# EAGLE design OMSI_TABLE_R12_v4 (EAGLE 9.6.1)
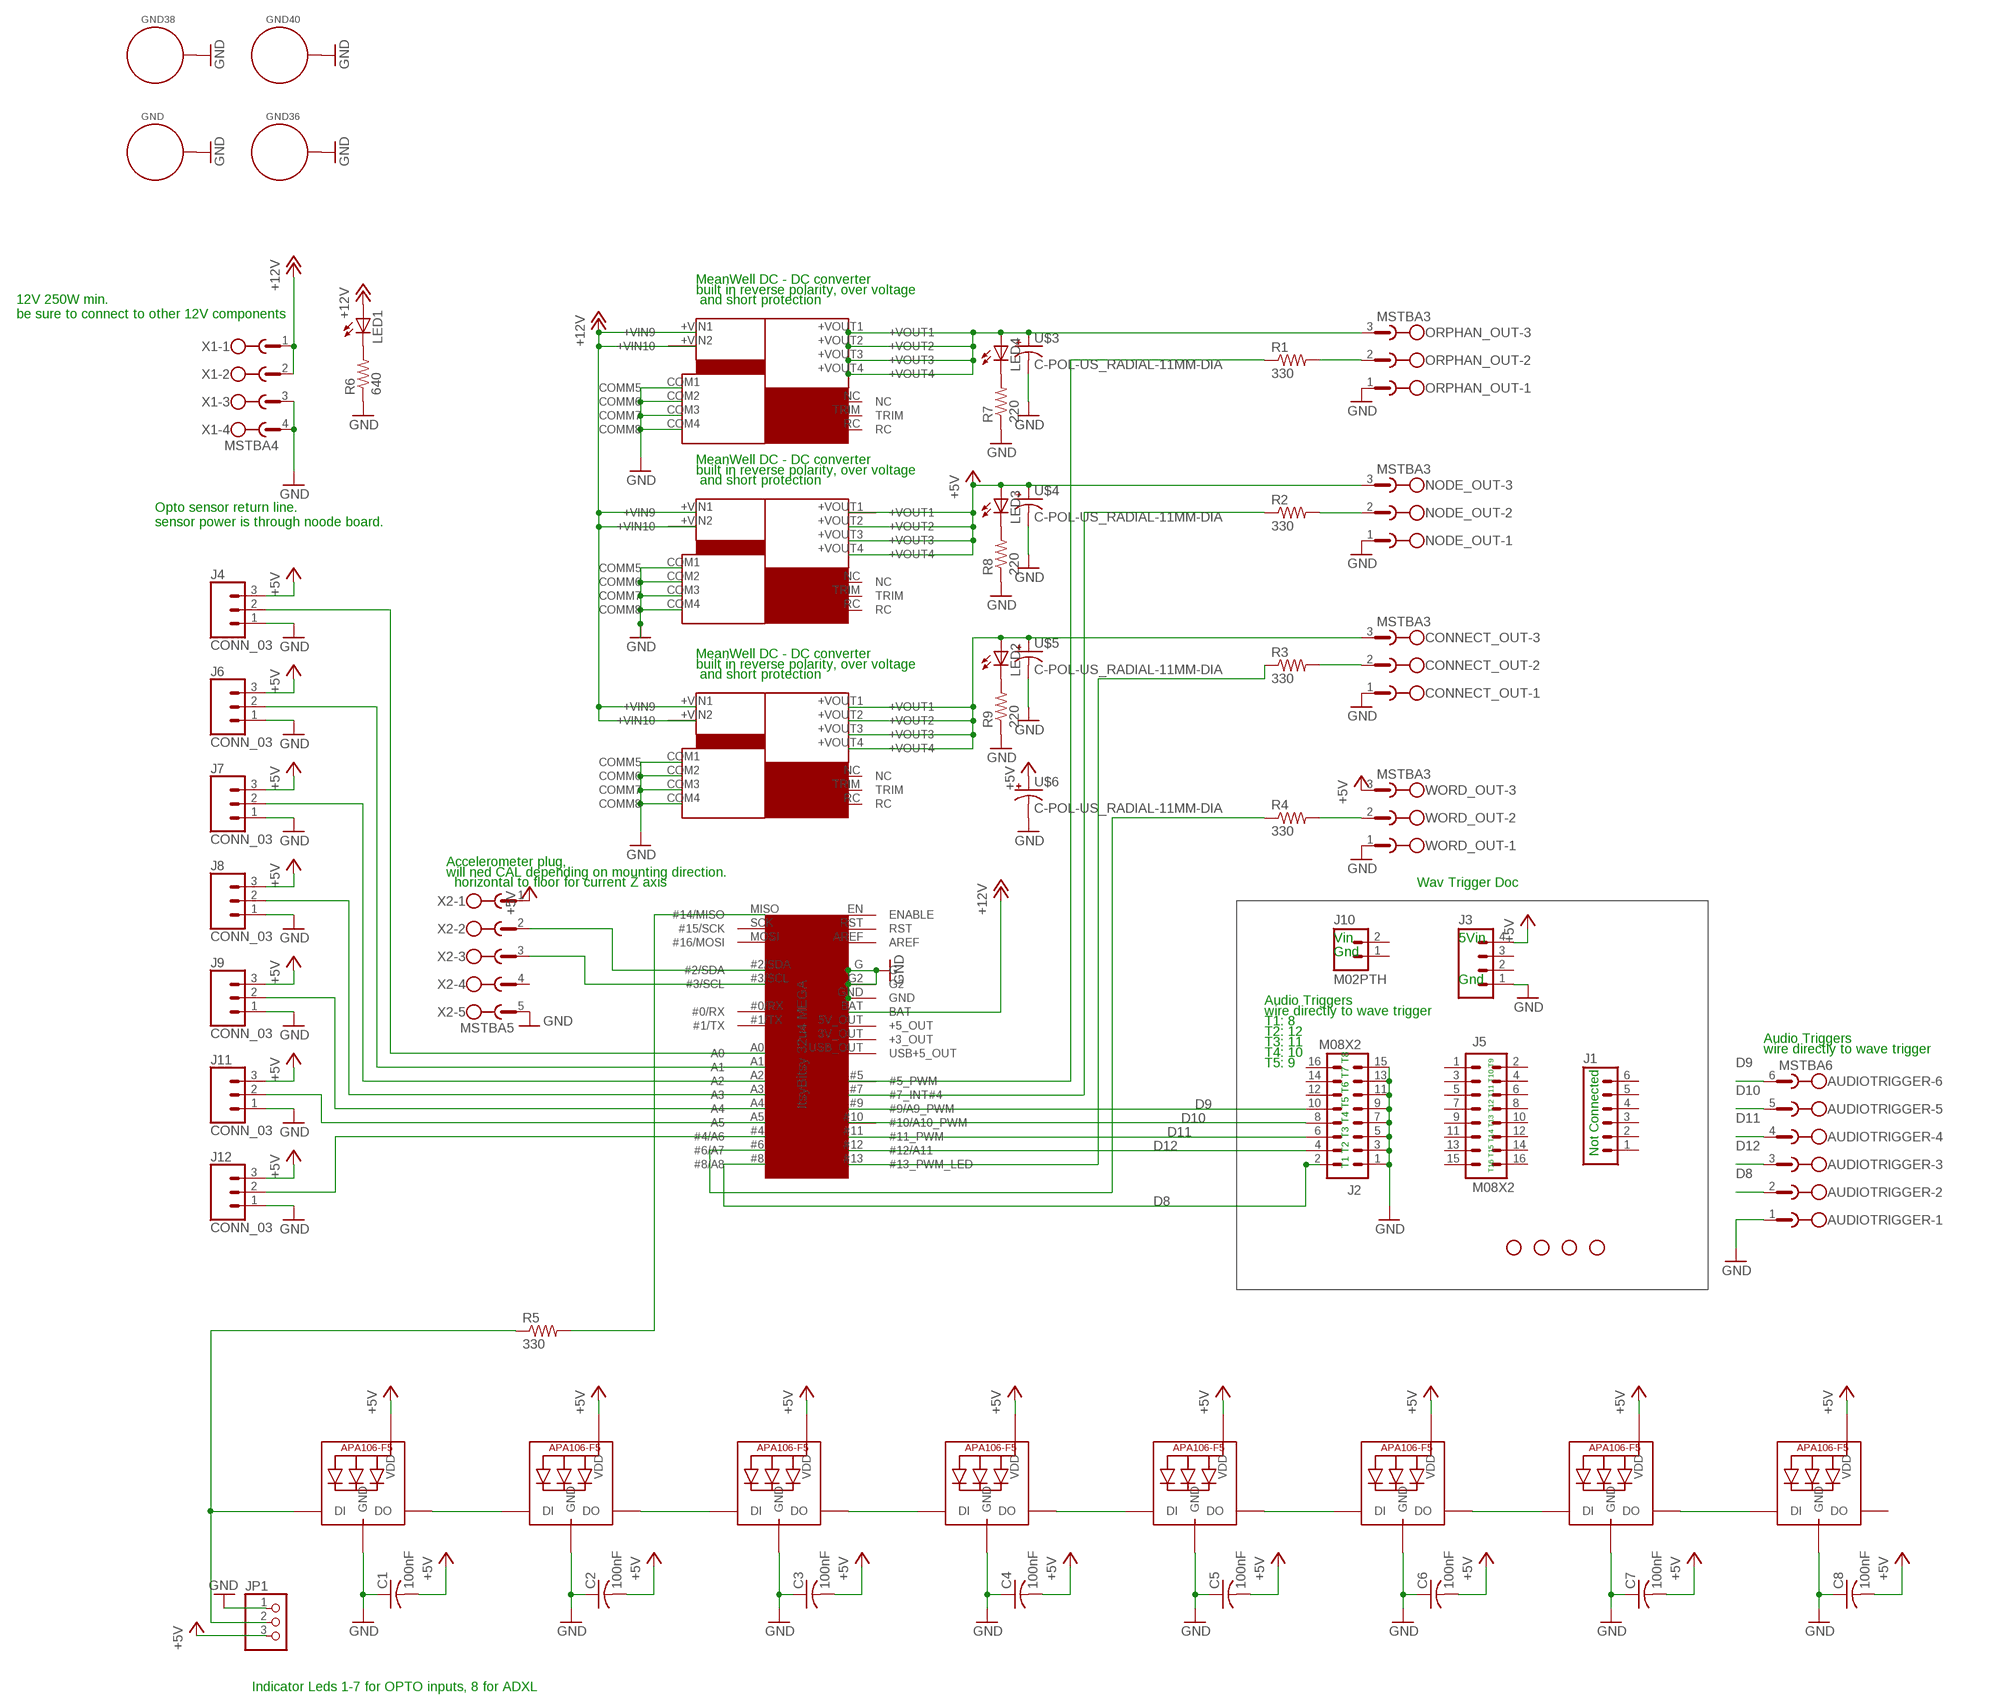
[diagram p0: schematic, sheet 1]

## Parts
AUDIOTRIGGER  MSTBA6  [MSTBA6]
C1  100nF  C-USC0805  [C0805]
C2  100nF  C-USC0805  [C0805]
C3  100nF  C-USC0805  [C0805]
C4  100nF  C-USC0805  [C0805]
C5  100nF  C-USC0805  [C0805]
C6  100nF  C-USC0805  [C0805]
C7  100nF  C-USC0805  [C0805]
C8  100nF  C-USC0805  [C0805]
CONNECT_OUT  MSTBA3  [MSTBA3]
GND  STANDOFF_ELECTRICAL5-32  [STANDOFF_ELECTRICAL_5_32]
GND36  STANDOFF_ELECTRICAL5-32  [STANDOFF_ELECTRICAL_5_32]
GND38  STANDOFF_ELECTRICAL5-32  [STANDOFF_ELECTRICAL_5_32]
GND40  STANDOFF_ELECTRICAL5-32  [STANDOFF_ELECTRICAL_5_32]
J1  M06SIP  [1X06]
J2  M08X2  [2X8]
J3  M04PTH  [1X04]
J4  CONN_03  [1X03_3.5MM_RA]
J5  M08X2  [2X8]
J6  CONN_03  [1X03_3.5MM_RA]
J7  CONN_03  [1X03_3.5MM_RA]
J8  CONN_03  [1X03_3.5MM_RA]
J9  CONN_03  [1X03_3.5MM_RA]
J10  M02PTH  [1X02]
J11  CONN_03  [1X03_3.5MM_RA]
J12  CONN_03  [1X03_3.5MM_RA]
JP1  PINHD-1X3  [1X03]
LED1  LEDCHIPLED_1206  [CHIPLED_1206]
LED2  LEDCHIPLED_1206  [CHIPLED_1206]
LED3  LEDCHIPLED_1206  [CHIPLED_1206]
LED4  LEDCHIPLED_1206  [CHIPLED_1206]
LED5  APA106-F5  [APA106-F5]
LED6  APA106-F5  [APA106-F5]
LED7  APA106-F5  [APA106-F5]
LED8  APA106-F5  [APA106-F5]
LED9  APA106-F5  [APA106-F5]
LED10  APA106-F5  [APA106-F5]
LED11  APA106-F5  [APA106-F5]
LED12  APA106-F5  [APA106-F5]
MEANWELL_NID100_1  MEANWELL_NID100  [MEANWELL_NID100]
MEANWELL_NID100_2  MEANWELL_NID100  [MEANWELL_NID100]
MEANWELL_NID100_3  MEANWELL_NID100  [MEANWELL_NID100]
NODE_OUT  MSTBA3  [MSTBA3]
ORPHAN_OUT  MSTBA3  [MSTBA3]
R1  330  R-US_AXIAL-11.7MM-PITCH  [RESAD1176W63L850D250B]
R2  330  R-US_AXIAL-11.7MM-PITCH  [RESAD1176W63L850D250B]
R3  330  R-US_AXIAL-11.7MM-PITCH  [RESAD1176W63L850D250B]
R4  330  R-US_AXIAL-11.7MM-PITCH  [RESAD1176W63L850D250B]
R5  330  R-US_AXIAL-11.7MM-PITCH  [RESAD1176W63L850D250B]
R6  640  R-US_R0805  [R0805]
R7  220  R-US_R0805  [R0805]
R8  220  R-US_R0805  [R0805]
R9  220  R-US_R0805  [R0805]
STANDOFF5  STAND-OFF  [STAND-OFF]
STANDOFF6  STAND-OFF  [STAND-OFF]
STANDOFF7  STAND-OFF  [STAND-OFF]
STANDOFF8  STAND-OFF  [STAND-OFF]
U$1  ITSYBITSY_32U4  [ITSYBITSY_32U4]
U$3  C-POL-US_RADIAL-11MM-DIA  [CAPPRD508W65D1000H1100B]
U$4  C-POL-US_RADIAL-11MM-DIA  [CAPPRD508W65D1000H1100B]
U$5  C-POL-US_RADIAL-11MM-DIA  [CAPPRD508W65D1000H1100B]
U$6  C-POL-US_RADIAL-11MM-DIA  [CAPPRD508W65D1000H1100B]
WORD_OUT  MSTBA3  [MSTBA3]
X1  MSTBA4  [MSTBA4]
X2  MSTBA5  [MSTBA5]

## Nets
+5V: C1.2 C2.2 C3.2 C4.2 C5.2 C6.2 C7.2 C8.2 J3.4 J4.3 J6.3 J7.3 J8.3 J9.3 J11.3 J12.3 JP1.3 LED3.A LED5.P$3(VDD) LED6.P$3(VDD) LED7.P$3(VDD) LED8.P$3(VDD) LED9.P$3(VDD) LED10.P$3(VDD) LED11.P$3(VDD) LED12.P$3(VDD) MEANWELL_NID100_3.+VOUT1 MEANWELL_NID100_3.+VOUT2 MEANWELL_NID100_3.+VOUT3 MEANWELL_NID100_3.+VOUT4 NODE_OUT.3 U$4.1(+) U$6.1(+) WORD_OUT.3 X2.1
+12V: LED1.A MEANWELL_NID100_1.+VIN1(+VIN9) MEANWELL_NID100_1.+VIN2(+VIN10) MEANWELL_NID100_2.+VIN1(+VIN9) MEANWELL_NID100_2.+VIN2(+VIN10) MEANWELL_NID100_3.+VIN1(+VIN9) MEANWELL_NID100_3.+VIN2(+VIN10) U$1.BAT X1.1 X1.2
A0: J4.2 U$1.A0
A1: J6.2 U$1.A1
A2: J7.2 U$1.A2
A3: J8.2 U$1.A3
A4: J9.2 U$1.A4
A5: J11.2 U$1.A5
D4: J12.2 U$1.#4(#4/A6)
D6: R4.1 U$1.#6(#6/A7)
D8: AUDIOTRIGGER.2 J2.2 U$1.#8(#8/A8)
D9: AUDIOTRIGGER.6 J2.10 U$1.#9(#9/A9_PWM)
D10: AUDIOTRIGGER.5 J2.8 U$1.#10(#10/A10_PWM)
D11: AUDIOTRIGGER.4 J2.6 U$1.#11(#11_PWM)
D12: AUDIOTRIGGER.3 J2.4 U$1.#12(#12/A11)
D13: R3.1 U$1.#13(#13_PWM_LED)
GND: AUDIOTRIGGER.1 C1.1 C2.1 C3.1 C4.1 C5.1 C6.1 C7.1 C8.1 CONNECT_OUT.1 GND36.P1 GND38.P1 GND40.P1 GND.P1 J2.1 J2.3 J2.5 J2.7 J2.9 J2.11 J2.13 J2.15 J3.1 J4.1 J6.1 J7.1 J8.1 J9.1 J11.1 J12.1 JP1.1 LED5.P$2(GND) LED6.P$2(GND) LED7.P$2(GND) LED8.P$2(GND) LED9.P$2(GND) LED10.P$2(GND) LED11.P$2(GND) LED12.P$2(GND) MEANWELL_NID100_1.COM1(COMM5) MEANWELL_NID100_1.COM2(COMM6) MEANWELL_NID100_1.COM3(COMM7) MEANWELL_NID100_1.COM4(COMM8) MEANWELL_NID100_2.COM1(COMM5) MEANWELL_NID100_2.COM2(COMM6) MEANWELL_NID100_2.COM3(COMM7) MEANWELL_NID100_2.COM4(COMM8) MEANWELL_NID100_3.COM1(COMM5) MEANWELL_NID100_3.COM2(COMM6) MEANWELL_NID100_3.COM3(COMM7) MEANWELL_NID100_3.COM4(COMM8) NODE_OUT.1 ORPHAN_OUT.1 R6.1 R7.1 R8.1 R9.1 U$1.G U$1.G2 U$1.GND U$3.2(-) U$4.2(-) U$5.2(-) U$6.2(-) WORD_OUT.1 X1.3 X1.4 X2.5
MISO: R5.2 U$1.MISO(#14/MISO)
N$1: LED4.A MEANWELL_NID100_2.+VOUT1 MEANWELL_NID100_2.+VOUT2 MEANWELL_NID100_2.+VOUT3 MEANWELL_NID100_2.+VOUT4 ORPHAN_OUT.3 U$3.1(+)
N$7: CONNECT_OUT.3 LED2.A MEANWELL_NID100_1.+VOUT1 MEANWELL_NID100_1.+VOUT2 MEANWELL_NID100_1.+VOUT3 MEANWELL_NID100_1.+VOUT4 U$5.1(+)
N$9: ORPHAN_OUT.2 R1.2
N$10: R1.1 U$1.#5(#5_PWM)
N$11: NODE_OUT.2 R2.2
N$15: R2.1 U$1.#7(#7_INT#4)
N$16: CONNECT_OUT.2 R3.2
N$18: R4.2 WORD_OUT.2
N$33: JP1.2 LED5.P$4(DI) R5.1
N$34: LED1.C R6.2
N$35: LED4.C R7.2
N$36: LED3.C R8.2
N$37: LED2.C R9.2
N$38: LED5.P$1(DO) LED6.P$4(DI)
N$41: LED6.P$1(DO) LED7.P$4(DI)
N$43: LED7.P$1(DO) LED8.P$4(DI)
N$45: LED8.P$1(DO) LED9.P$4(DI)
N$47: LED9.P$1(DO) LED10.P$4(DI)
N$49: LED10.P$1(DO) LED11.P$4(DI)
N$51: LED11.P$1(DO) LED12.P$4(DI)
SCL: U$1.#3/SCL X2.3
SDA: U$1.#2/SDA X2.2
Unconnected: J1.1 J1.2 J1.3 J1.4 J1.5 J1.6 J2.12 J2.14 J2.16 J3.2 J3.3 J5.1 J5.2 J5.3 J5.4 J5.5 J5.6 J5.7 J5.8 J5.9 J5.10 J5.11 J5.12 J5.13 J5.14 J5.15 J5.16 J10.1 J10.2 LED12.P$1(DO) MEANWELL_NID100_1.NC MEANWELL_NID100_1.RC MEANWELL_NID100_1.TRIM MEANWELL_NID100_2.NC MEANWELL_NID100_2.RC MEANWELL_NID100_2.TRIM MEANWELL_NID100_3.NC MEANWELL_NID100_3.RC MEANWELL_NID100_3.TRIM U$1.#0/RX U$1.#1/TX U$1.EN(ENABLE) U$1.MOSI(#16/MOSI) U$1.SCK(#15/SCK) X2.4

## Notes on the sheet
- MeanWell DC - DC converter
  built in reverse polarity, over voltage
   and short protection
- 12V 250W min.
  be sure to connect to other 12V components
- MeanWell DC - DC converter
  built in reverse polarity, over voltage
   and short protection
- Opto sensor return line.
  sensor power is through noode board.
- MeanWell DC - DC converter
  built in reverse polarity, over voltage
   and short protection
- Accelerometer plug, 
  will ned CAL depending on mounting direction.
    horizontal to floor for current Z axis
- Wav Trigger Doc
- Vin | 5Vin
- Gnd
- Gnd
- Audio Triggers
  wire directly to wave trigger
- Audio Triggers
  wire directly to wave trigger
  T1: 8
  T2: 12
  T3: 11
  T4: 10
  T5: 9
- Not Connected
- T1 T2 T3 T4 T5 T6 T7 T8
- T16 T15 T14 T13 T12 T11 T10 T9
- Indicator Leds 1-7 for OPTO inputs, 8 for ADXL

## Power pins joined to a net without a drawn wire
+3_OUT: U$1.3V_OUT(+3_OUT)
+5_OUT: U$1.5V_OUT(+5_OUT)
AREF: U$1.AREF
RST: U$1.RST
USB+5_OUT: U$1.USB_OUT(USB+5_OUT)

## Library data of the parts
AUDIOTRIGGER = con-phoenix-508:MSTBA6: PHOENIX; MF: FARNELL; MPN: 1757284; OC_FARNELL: 3705213; OC_NEWARK: 71C4165
C1-C8 = rcl:C-US: CAPACITOR, American symbol; SPICEPREFIX: C
CONNECT_OUT NODE_OUT ORPHAN_OUT WORD_OUT = con-phoenix-508:MSTBA3: PHOENIX; MF: FARNELL; MPN: 1757255; OC_FARNELL: 3705183; OC_NEWARK: 71C4162
GND GND36 GND38 GND40 = th_libraries:STANDOFF_ELECTRICAL: A standoff intended to be an electrically connected point. Pad size and stop size allow for a #8 Phillips pan screw head to make a solid connection to the board. Added 144mill drill hole that fits my normal wood screw
J1 = SparkFun-Connectors:M06: Header 6 Standard 6-pin 0.1" header. Use with straight break away headers (SKU : PRT-00116), right angle break away headers (PRT-00553), swiss pins (PRT-00743), machine pins (PRT-00117), and female headers (PRT-00115). Molex polarized connector foot print use with SKU : PRT-08094 with associated crimp pins and housings. NOTES ON THE VARIANTS LOCK and LOCK_LONGPADS... This footprint was designed to help hold the alignment of a through-hole component (i.e. 6-pin header) while soldering it into place. You may notice that each hole has been shifted either up or down by 0.005 of an inch from it's more standard position (which is a perfectly straight line). This slight alteration caused the pins (the squares in the middle) to touch the edges of the holes. Because they are alternating, it causes a "brace" to hold the component in place. 0.005 has proven to be the perfect amount of "off-center" position when using our standard breakaway headers. Although looks a little odd when you look at the bare footprint, once you have a header in there, the alteration is very hard to notice. Also, if you push a header all the way into place, it is covered up entirely on the bottom side. This idea of altering the position of holes to aid alignment will be further integrated into the Sparkfun Library for other footprints. It can help hold any component with 3 or more connection pins.
J2 J5 = SparkFun-Connectors:M08X2: .1" headers, two rows of 8 each
J3 = SparkFun-Connectors:M04: Header 4 Standard 4-pin 0.1" header. Use with straight break away headers (SKU : PRT-00116), right angle break away headers (PRT-00553), swiss pins (PRT-00743), machine pins (PRT-00117), and female headers (PRT-00115). Molex polarized connector foot print use with SKU : PRT-08231 with associated crimp pins and housings. 1MM SMD Version SKU: PRT-10208
J4 J6-J9 J11 J12 = th_libraries:CONN_03
J10 = SparkFun-Connectors:M02: Standard 2-pin 0.1" header. Use with - straight break away headers ( PRT-00116) - right angle break away headers (PRT-00553) - swiss pins (PRT-00743) - machine pins (PRT-00117) - female headers (PRT-00115) Molex polarized connector foot print use with: PRT-08233 with associated crimp pins and housings. 2.54_SCREWTERM for use with PRT-10571. 3.5mm Screw Terminal footprints for PRT-08084 5mm Screw Terminal footprints for use with PRT-08433
JP1 = pinhead:PINHD-1X3: PIN HEADER
LED1-LED4 = adafruit:LED: LED OSRAM: - CHIPLED LG R971, LG N971, LY N971, LG Q971, LY Q971, LO R971, LY R971 LH N974, LH R974 LS Q976, LO Q976, LY Q976 LO Q996 - Hyper CHIPLED LW Q18S LB Q993, LB Q99A, LB R99A - SideLED LS A670, LO A670, LY A670, LG A670, LP A670 LB A673, LV A673, LT A673, LW A673 LH A674 LY A675 LS A676, LA A676, LO A676, LY A676, LW A676 LS A679, LY A679, LG A679 - Hyper Micro SIDELED® LS Y876, LA Y876, LO Y876, LY Y876 LT Y87S - SmartLED LW L88C, LW L88S LB L89C, LB L89S, LG L890 LS L89K, LO L89K, LY L89K LS L896, LA L896, LO L896, LY L896 - TOPLED LS T670, LO T670, LY T670, LG T670, LP T670 LSG T670, LSP T670, LSY T670, LOP T670, LYG T670 LG T671, LOG T671, LSG T671 LB T673, LV T673, LT T673, LW T673 LH T674 LS T676, LA T676, LO T676, LY T676, LB T676, LH T676, LSB T676, LW T676 LB T67C, LV T67C, LT T67C, LS T67K, LO T67K, LY T67K, LW E67C LS E67B, LA E67B, LO E67B, LY E67B, LB E67C, LV E67C, LT E67C LW T67C LS T679, LY T679, LG T679 LS T770, LO T770, LY T770, LG T770, LP T770 LB T773, LV T773, LT T773, LW T773 LH T774 LS E675, LA E675, LY E675, LS T675 LS T776, LA T776, LO T776, LY T776, LB T776 LHGB T686 LT T68C, LB T68C - Hyper Mini TOPLED® LB M676 - Mini TOPLED Santana® LG M470 LS M47K, LO M47K, LY M47K Source: http://www.osram.convergy.de/
LED5-LED12 = th_libraries:APA106-F5: Same LEDs are for sale at sparkfun and pololu. Digikey Link <https://www.digikey.com/product-detail/en/sparkfun-electronics/COM-12986/1568-1213-ND/5673799> Pinout: https://a.pololu-files.com/picture/0J5433.1200.jpg?cdc0daa0c2fd98e38ed59b7d43758c6b https://www.sparkfun.com/products/12986
MEANWELL_NID100_1-MEANWELL_NID100_3 = _Library_test.fef566de-641b-440a-8c62-be1921989066.flbr:MEANWELL_NID100
R1-R5 = Resistor:R-US: Resistor Fixed - ANSI; CATEGORY: Resistor; SUB-CATEGORY: Fixed
R6-R9 = adafruit:R-US_: RESISTOR, American symbol
STANDOFF5-STANDOFF8 = SparkFun-Electromechanical:STAND-OFF: #4 Stand Off This is the mechanical footprint for a #4 phillips button head screw. Use the keepout ring to avoid running the screw head into surrounding components. SKU : PRT-00447
U$1 = _Library_test.fef566de-641b-440a-8c62-be1921989066.flbr:ITSYBITSY_32U4
U$3-U$6 = Capacitor:C-POL-US: Capacitor Polarised - ANSI; CATEGORY: Capacitor
X1 = con-phoenix-508:MSTBA4: PHOENIX; MF: FARNELL; MPN: 1757268; OC_FARNELL: 3705195; OC_NEWARK: 71C4163
X2 = con-phoenix-508:MSTBA5: PHOENIX; MPN: 1757271; OC_FARNELL: 3705201; OC_NEWARK: 71C4164

## Board
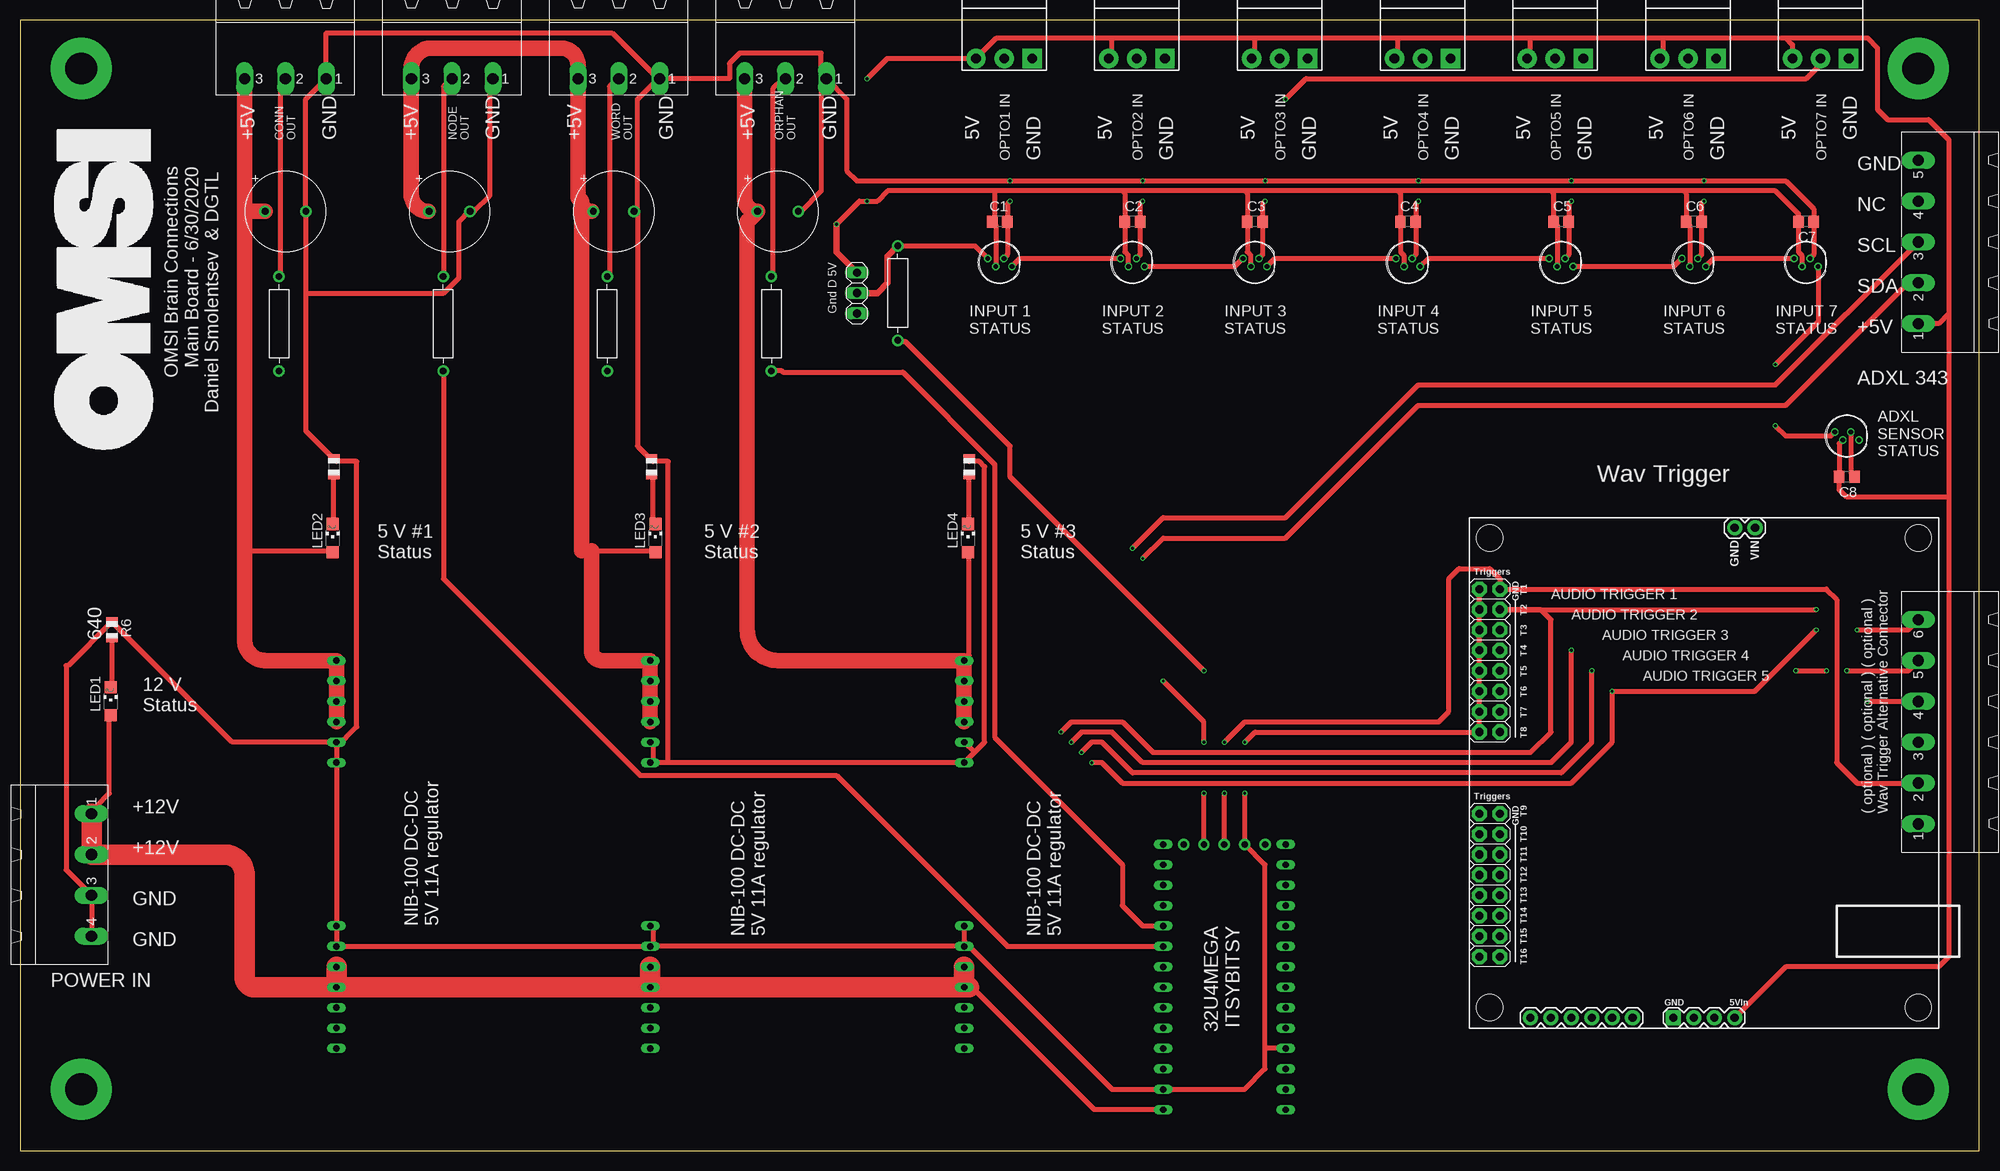
[diagram p1: board, top side]
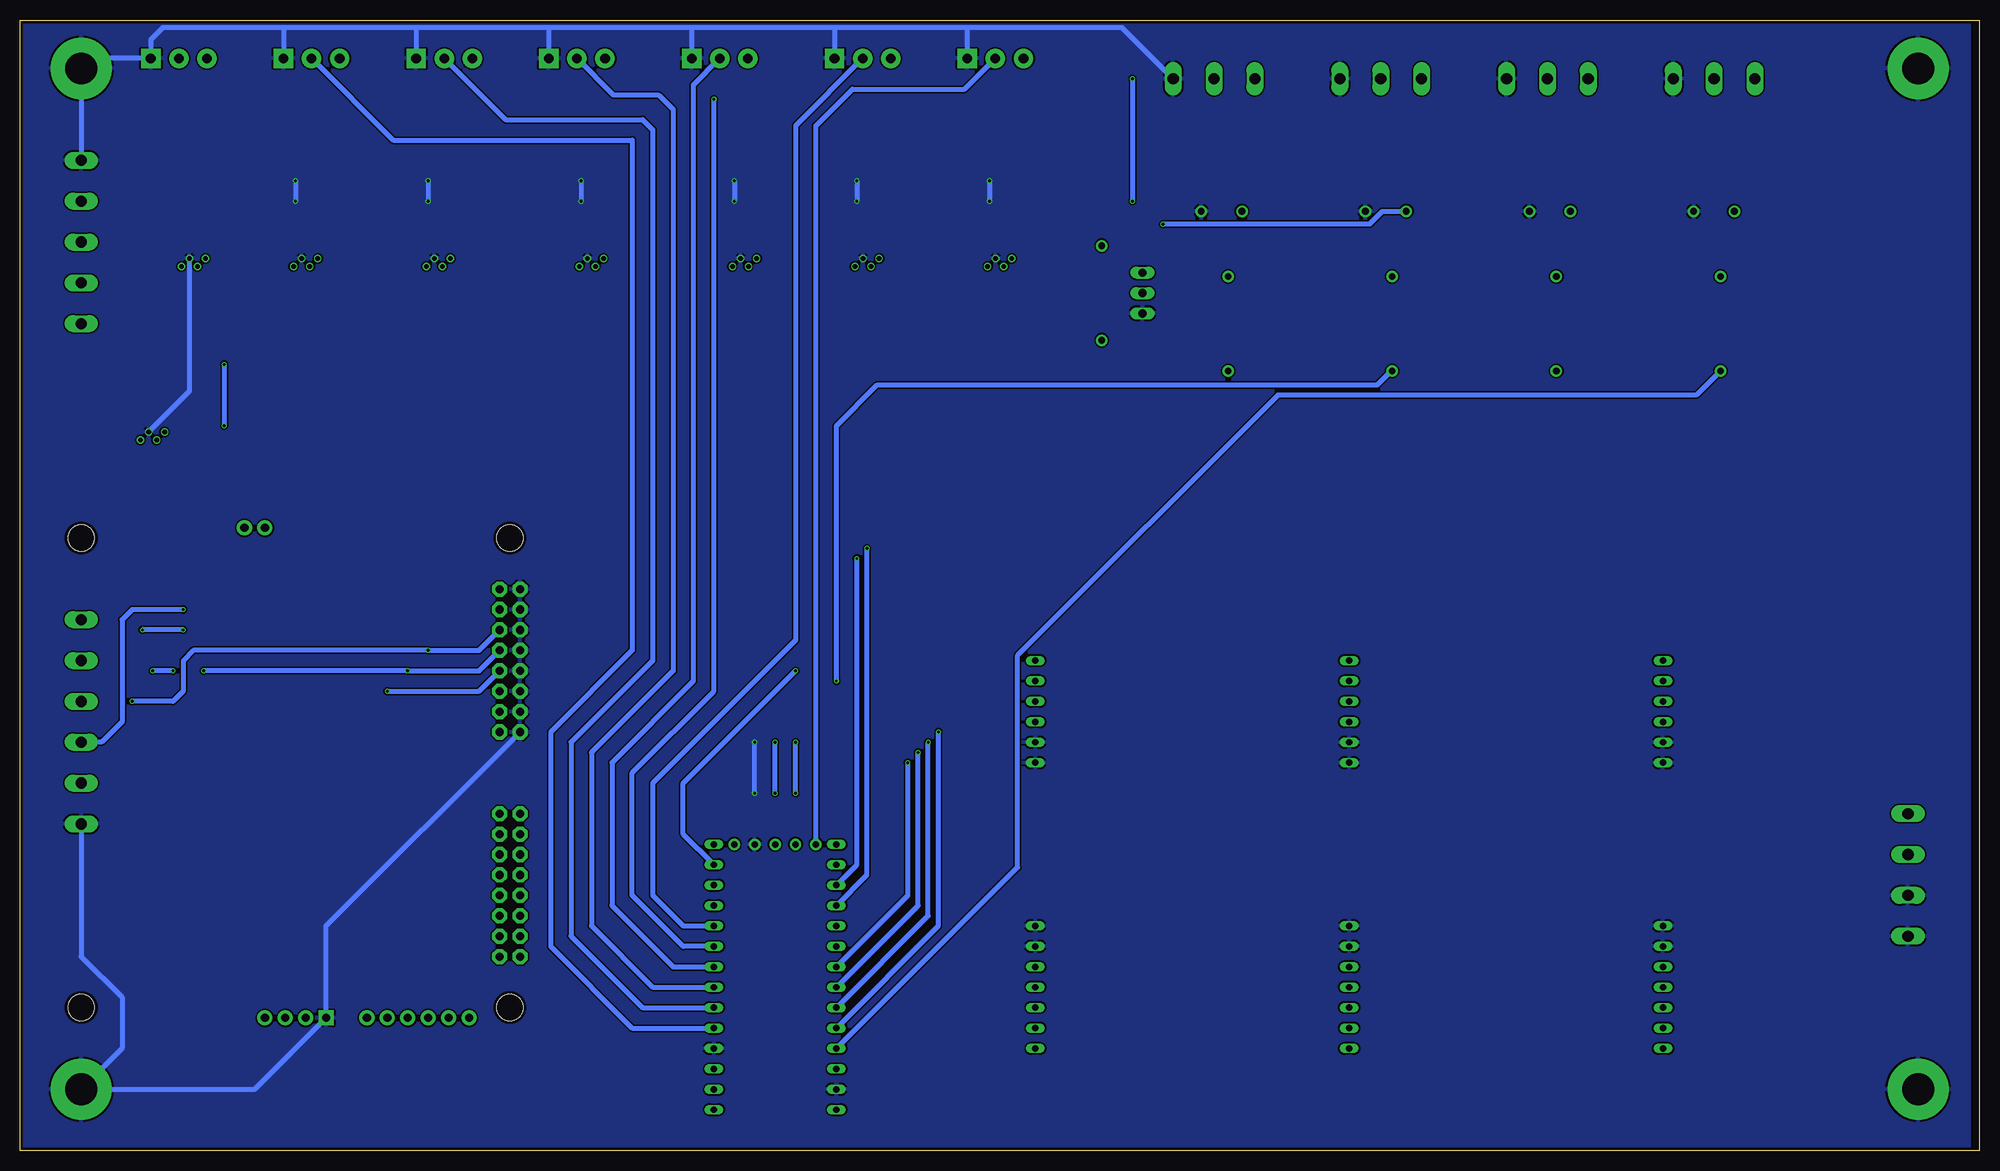
[diagram p2: board, bottom side, seen from below]

Size 243.82 x 140.64 mm. Coordinates in mm from the lower left corner, seen from the top.
Outline: 0,0 243.82,0 243.82,140.64 0,140.64 0,0
Copper layers (1*16): Top 0.035559375mm / dielectric 1.6mm / Bottom 0.035559375mm
Design rules "oshpark-2layer_8mil": minimum track width 8mil, minimum drill 10mil, track to track 8mil, track to pad 8mil, pad to pad 8mil, via to via 8mil, smd to smd 8mil, copper to edge 15mil, drill to drill 8mil, minimum pad ring 5mil, minimum via ring 5mil, stop-mask expansion 2.5mil, vias tented up to drill 0mil, thermal gap 10mil

### Footprints (pad centres in the part's own frame; a part is rotated, then mirrored left to right if it is on the bottom)
MSTBA6 = drill 1.397 long: 1 -12.7,5.08; 2 -7.62,5.08; 3 -2.54,5.08; 4 2.54,5.08; 5 7.62,5.08; 6 12.7,5.08
C0805 = smd 1.3 x 1.5: 1 -0.95,0; 2 0.95,0
MSTBA3 = drill 1.397 long: 1 -5.08,5.08; 2 0,5.08; 3 5.08,5.08
STANDOFF_ELECTRICAL_5_32 = drill 3.969 pad 7.62: P1 0,0
1X06 = drill 1.016 pad 1.88: 1 0,0; 2 2.54,0; 3 5.08,0; 4 7.62,0; 5 10.16,0; 6 12.7,0
2X8 = drill 1.016 pad 1.88 octagon: 1 0,0; 2 0,2.54; 3 2.54,0; 4 2.54,2.54; 5 5.08,0; 6 5.08,2.54; 7 7.62,0; 8 7.62,2.54; 9 10.16,0; 10 10.16,2.54; 11 12.7,0; 12 12.7,2.54; 13 15.24,0; 14 15.24,2.54; 15 17.78,0; 16 17.78,2.54
1X04 = drill 1.016 pad 1.88 square: 1 0,0 | drill 1.016 pad 1.88: 2 2.54,0; 3 5.08,0; 4 7.62,0
1X03_3.5MM_RA = drill 1.2 pad 2.413 square: 1 -0.228,0.023 | drill 1.2 pad 2.413: 2 3.272,0.023; 3 6.772,0.023
1X02 = drill 1.016 pad 1.88: 1 0,0; 2 2.54,0
1X03 = drill 1.016 long: 1 -2.54,0; 2 0,0; 3 2.54,0
CHIPLED_1206 = smd 1.5 x 1.5: A 0,-1.75; C 0,1.75
APA106-F5 = drill 0.6: P$1 1.5,-0.5; P$2 0.5,0.5; P$3 -0.5,-0.5; P$4 -1.5,0.5
MEANWELL_NID100 = drill 0.8 long: +VIN1 0,-20.32; +VIN2 0,-22.86; +VOUT1 0,17.78; +VOUT2 0,15.24; +VOUT3 0,12.7; +VOUT4 0,10.16; COM1 0,7.62; COM2 0,5.08; COM3 0,-15.24; COM4 0,-17.78; NC 0,-25.4; RC 0,-30.48; TRIM 0,-27.94
RESAD1176W63L850D250B = drill 0.83 pad 1.43: 1 -5.88,0; 2 5.88,0
R0805 = smd 1.1 x 1.4: 1 -1,0; 2 1,0
STAND-OFF = hole 3.302: 0,0
ITSYBITSY_32U4 = drill 0.8 long: 3V_OUT -7.62,-17.78; 5V_OUT -7.62,12.7; #0/RX 7.62,-17.78; #1/TX 7.62,-15.24; #2/SDA 7.62,-12.7; #3/SCL 7.62,-10.16; #5 7.62,-7.62; #7 7.62,-5.08; #9 7.62,-2.54; #10 7.62,0; #11 7.62,2.54; #12 7.62,5.08; #13 7.62,7.62; A0 -7.62,5.08; A1 -7.62,2.54; A2 -7.62,0; A3 -7.62,-2.54; A4 -7.62,-5.08; A5 -7.62,-7.62; AREF -7.62,10.16; BAT 7.62,15.24; G2 7.62,12.7; GND -7.62,7.62; MISO -7.62,-15.24; MOSI -7.62,-12.7; RST -7.62,15.24; SCK -7.62,-10.16; USB_OUT 7.62,10.16 | drill 0.8 pad 1.422: #4 5.08,-17.78; #6 2.54,-17.78; #8 0,-17.78; EN -5.08,-17.78; G -2.54,-17.78
CAPPRD508W65D1000H1100B = drill 0.85 pad 1.45: 1 -2.54,0; 2 2.54,0
MSTBA4 = drill 1.397 long: 1 -7.62,5.08; 2 -2.54,5.08; 3 2.54,5.08; 4 7.62,5.08
MSTBA5 = drill 1.397 long: 1 -10.16,5.08; 2 -5.08,5.08; 3 0,5.08; 4 5.08,5.08; 5 10.16,5.08

### Placement (x,y rotation side)
AUDIOTRIGGER  241.3,53.34 90 top
C1  121.92,115.57 180 top
C2  138.43,115.57 180 top
C3  153.67,115.57 180 top
C4  172.72,115.57 180 top
C5  191.77,115.57 180 top
C6  208.28,115.57 180 top
C7  222.25,115.57 180 top
C8  227.33,83.82 180 top
CONNECT_OUT  33.02,138.43 180 top
GND  7.62,7.62 0 top
GND36  236.22,7.62 0 top
GND38  7.62,134.62 0 top
GND40  236.22,134.62 0 top
J1  200.66,16.51 180 top
J2  181.61,69.85 270 top
J3  205.74,16.51 0 top
J4  210.82,135.89 180 top
J5  181.61,41.91 270 top
J6  194.31,135.89 180 top
J7  177.8,135.89 180 top
J8  160.02,135.89 180 top
J9  227.33,135.89 180 top
J10  213.36,77.47 0 top
J11  142.24,135.89 180 top
J12  125.73,135.89 180 top
JP1  104.14,106.68 90 top
LED1  11.27,55.88 0 top
LED2  38.89,76.2 0 top
LED3  79.06,76.2 0 top
LED4  117.95,76.2 0 top
LED5  121.92,110.49 0 top
LED6  138.43,110.49 0 top
LED7  153.67,110.49 0 top
LED8  172.72,110.49 0 top
LED9  191.77,110.49 0 top
LED10  208.28,110.49 0 top
LED11  222.25,110.49 0 top
LED12  227.33,88.9 0 top
MEANWELL_NID100_1  39.37,43.18 0 top
MEANWELL_NID100_2  117.48,43.18 0 top
MEANWELL_NID100_3  78.42,43.18 0 top
NODE_OUT  53.76,138.43 180 top
ORPHAN_OUT  95.25,138.43 180 top
R1  93.5,102.87 90 top
R2  52.65,102.87 90 top
R3  32.23,102.87 90 top
R4  73.07,102.87 90 top
R5  109.22,106.68 270 top
R6  11.43,64.77 270 top
R7  118.11,85.09 270 top
R8  78.58,85.09 270 top
R9  39.05,85.09 270 top
STANDOFF5  182.88,76.2 270 top
STANDOFF6  182.88,17.78 270 top
STANDOFF7  236.22,76.2 270 top
STANDOFF8  236.22,17.78 270 top
U$1  149.86,20.32 180 top
U$3  94.29,116.84 0 top
U$4  73.87,116.84 0 top
U$5  33.02,116.84 0 top
U$6  53.44,116.84 0 top
WORD_OUT  74.51,138.43 180 top
X1  3.81,34.29 270 top
X2  241.3,113.03 90 top

### Tracks (layer width: path | path; a pad name or v marks a point on that pad's centre or on a via)
+5V  (via drill 0.35)
  Top 0.61: 69.85,74.61 71.12,74.61 78.74,74.61 LED3.A | U$6.1 50.8,116.84 | U$4.1 71.12,116.84 | v101.6,115.25 104.46,118.11 v105.41,118.11 106.68,118.11 107.95,119.38 121.29,119.38 | v105.41,133.35 107.93,135.87 J12.3 121.52,138.43 135.89,138.43 | 135.89,138.43 153.67,138.43 | 153.67,138.43 171.45,138.43 | 171.45,138.43 187.96,138.43 | 187.96,138.43 204.47,138.43 | 204.47,138.43 219.71,138.43 | 219.71,138.43 220.56,137.58 J9.3 | J4.3 204.47,136.29 204.47,138.43 | J6.3 187.96,136.29 187.96,138.43 | J7.3 171.45,136.29 171.45,138.43 | J8.3 153.67,136.29 153.67,138.43 | J11.3 135.89,136.29 135.89,138.43 | 207.01,119.38 218.44,119.38 221.3,116.52 C7.2 221.3,111.79 221.71,111.39 221.71,110.03 LED11.P$3 | 207.01,119.38 190.5,119.38 | 190.5,119.38 171.45,119.38 | 171.45,119.38 152.4,119.38 | 152.4,119.38 137.16,119.38 | 137.16,119.38 121.29,119.38 | 219.71,138.43 229.87,138.43 231.14,137.16 231.14,129.54 232.41,128.27 237.49,128.27 240.03,125.73 240.03,104.14 | 240.03,104.14 238.76,102.87 X2.1 | 240.03,104.14 240.03,81.28 | 240.03,81.28 240.03,24.13 238.76,22.86 219.71,22.86 J3.4 | LED5.P$3 121.42,115.12 C1.2 121.29,115.88 121.29,119.38 | LED6.P$3 137.89,110.03 137.89,111.39 137.48,111.79 C2.2 137.48,119.06 137.16,119.38 | LED7.P$3 153.13,110.03 153.13,111.39 152.72,111.79 C3.2 152.72,119.06 152.4,119.38 | LED8.P$3 172.18,110.03 172.18,111.39 171.77,111.79 C4.2 171.77,119.06 171.45,119.38 | LED9.P$3 191.27,115.12 C5.2 190.82,119.06 190.5,119.38 | LED10.P$3 207.78,115.12 C6.2 207.33,119.06 207.01,119.38 | LED12.P$3 226.38,87.95 C8.2 226.38,82.23 227.33,81.28 240.03,81.28
  Top 0.813: v101.6,115.25 101.6,111.76 JP1.3
  Top 1.905: 50.8,116.84 arc-90 48.68,118.96 NODE_OUT.3 48.68,134.62 arc-90 51.22,137.16 67.31,137.16 arc-90 69.43,135.04 WORD_OUT.3 69.43,118.53 69.85,118.11 | 69.85,118.11 arc90 71.12,116.84 | 69.85,118.11 69.85,74.61 | 71.12,74.61 71.12,62.23 arc90 72.39,60.96 MEANWELL_NID100_3.+VOUT1 MEANWELL_NID100_3.+VOUT2 MEANWELL_NID100_3.+VOUT3 MEANWELL_NID100_3.+VOUT4
  Bottom 0.61: U$4.1 74.3,116.84 75.88,115.25 v101.6,115.25 | v105.41,133.35 v105.41,118.11
+12V
  Top 0.61: LED1.A 11.11,53.98 11.11,44.45 9.53,42.86 X1.1 | 118.11,20.32 119.06,19.69 133.67,5.08 U$1.BAT
  Top 2.54: X1.1 X1.2 25.4,36.83 arc-90 27.94,34.29 27.94,21.59 arc90 29.21,20.32 MEANWELL_NID100_1.+VIN2 | MEANWELL_NID100_1.+VIN1 MEANWELL_NID100_1.+VIN2 | MEANWELL_NID100_3.+VIN2 MEANWELL_NID100_1.+VIN2 | MEANWELL_NID100_2.+VIN2 118.11,20.32 | MEANWELL_NID100_2.+VIN2 MEANWELL_NID100_2.+VIN1 | MEANWELL_NID100_2.+VIN2 MEANWELL_NID100_3.+VIN2 | MEANWELL_NID100_3.+VIN1 MEANWELL_NID100_3.+VIN2
A0
  Bottom 0.61: J4.2 197.39,125.71 167.64,125.71 167.64,62.23 177.8,52.07 177.8,25.4 167.64,15.24 U$1.A0
A1
  Bottom 0.61: J6.2 183.42,128.25 166.35,128.25 165.1,127 165.1,60.96 175.26,50.8 175.26,26.67 166.37,17.78 U$1.A1
A2
  Bottom 0.61: J7.2 170.01,131.35 164.37,131.35 162.56,129.54 162.56,59.69 172.72,49.53 172.72,27.94 165.1,20.32 U$1.A2
A3
  Bottom 0.61: U$1.A3 162.56,22.86 170.18,30.48 170.18,48.26 160.02,58.42 160.02,132.59 J8.2
A4  (via drill 0.35)
  Top 0.61: v157.48,130.81 160.02,133.35 222.25,133.35 224.06,135.16 J9.2
  Bottom 0.61: U$1.A4 161.29,25.4 167.64,31.75 167.64,46.99 157.48,57.15 v157.48,130.81
A5
  Bottom 0.61: J11.2 147.32,127.52 147.32,111.76 147.32,63.5 165.1,45.72 165.1,31.75 161.29,27.94 U$1.A5
D4
  Bottom 0.61: U$1.#4 144.78,127.52 140.24,132.06 126.27,132.06 J12.2
D6  (via drill 0.35)
  Top 0.61: U$1.#6 v147.32,44.45 | v147.32,50.8 147.32,53.34 v142.24,58.42
  Bottom 0.61: R4.1 73.34,96.84 74.93,95.25 137.16,95.25 142.24,90.17 v142.24,58.42 | v147.32,44.45 v147.32,50.8
D8  (via drill 0.35)
  Top 0.61: U$1.#8 v149.86,44.45 | v149.86,50.8 152.4,53.34 176.53,53.34 177.8,54.61 177.8,71.12 179.07,72.39 182.88,72.39 184.15,71.12 J2.2 224.79,69.85 226.06,68.58 226.06,48.26 228.6,45.72 AUDIOTRIGGER.2
  Bottom 0.61: v149.86,44.45 v149.86,50.8
D9  (via drill 0.35)
  Top 0.61: v133.35,48.26 134.62,48.26 137.16,45.72 193.04,45.72 198.12,50.8 v198.12,57.15 215.9,57.15 v223.52,64.77 | v228.6,64.77 234.95,64.77 AUDIOTRIGGER.6
  Bottom 0.61: U$1.#9 133.35,31.75 v133.35,48.26 | v198.12,57.15 186.69,57.15 J2.10 | v223.52,64.77 v228.6,64.77
D10  (via drill 0.35)
  Top 0.61: v195.58,59.69 195.58,50.8 191.77,46.99 138.43,46.99 134.62,50.8 133.35,50.8 v132.08,49.53 | v220.98,59.69 v224.79,59.69 | v227.33,59.69 234.95,59.69 AUDIOTRIGGER.5
  Bottom 0.61: U$1.#10 132.08,30.48 v132.08,49.53 | J2.8 186.69,59.69 v195.58,59.69 v220.98,59.69 | v224.79,59.69 v227.33,59.69
D11  (via drill 0.35)
  Top 0.61: v193.04,62.23 193.04,50.8 190.5,48.26 139.7,48.26 135.89,52.07 132.08,52.07 v130.81,50.8 | v229.87,55.88 AUDIOTRIGGER.4
  Bottom 0.61: U$1.#11 130.81,29.21 v130.81,50.8 | J2.6 186.69,62.23 v193.04,62.23 222.25,62.23 223.52,60.96 223.52,57.15 224.79,55.88 v229.87,55.88
D12  (via drill 0.35)
  Top 0.61: v129.54,52.07 130.81,53.34 137.16,53.34 140.97,49.53 187.96,49.53 190.5,52.07 190.5,66.04 189.23,67.31 J2.4 v223.52,67.31
  Bottom 0.61: U$1.#12 129.54,27.94 v129.54,52.07 | v223.52,67.31 229.87,67.31 231.14,66.04 231.14,53.34 233.68,50.8 AUDIOTRIGGER.3
D13
  Bottom 0.61: R3.1 32.38,96.84 35.24,93.98 87.31,93.98 119.7,61.6 119.7,35.24 U$1.#13
GND  (via drill 0.35)
  Top 0.61: 76.84,116.84 76.84,87.63 78.11,86.36 R8.1 78.74,85.72 80.65,85.72 80.65,48.26 | 79.38,133.35 76.84,130.81 76.84,116.84 | 76.84,116.84 U$4.2 | 78.74,48.26 78.74,50.8 MEANWELL_NID100_3.COM1 | 118.75,49.53 MEANWELL_NID100_2.COM2 80.65,48.26 | 118.75,49.53 120.02,50.8 120.02,85.09 119.38,85.72 118.11,85.72 R7.1 | 118.75,49.53 MEANWELL_NID100_2.COM1 | 80.65,48.26 78.74,48.26 | 78.74,48.26 MEANWELL_NID100_3.COM2 | 99.7,133.35 99.7,119.38 97.16,116.84 U$3.2 | 99.7,133.35 99.7,136.53 89.54,136.53 88.27,135.25 88.27,133.35 WORD_OUT.1 79.38,133.35 | 99.7,133.35 ORPHAN_OUT.1 102.87,130.81 102.87,121.92 104.14,120.65 v123.19,120.65 v139.7,120.65 v154.94,120.65 v173.99,120.65 v193.04,120.65 v209.55,120.65 219.71,120.65 223.2,117.16 C7.1 223.2,111.44 LED11.P$2 | NODE_OUT.1 58.42,133.35 58.42,118.74 56.52,116.84 U$6.2 55.88,116.84 54.61,115.57 54.61,108.58 52.7,106.68 35.56,106.68 | 35.56,106.68 U$5.2 35.56,130.81 CONNECT_OUT.1 38.1,139.06 73.66,139.06 79.38,133.35 | 35.56,106.68 35.56,89.53 38.73,86.36 R9.1 39.37,85.72 41.91,85.72 41.91,52.7 39.37,50.16 | 156.84,12.7 U$1.GND 154.94,12.7 | 78.74,25.4 78.74,27.94 MEANWELL_NID100_3.COM3 | MEANWELL_NID100_2.COM3 117.48,26.04 | 78.74,25.4 MEANWELL_NID100_2.COM4 117.48,26.04 | 78.74,25.4 MEANWELL_NID100_3.COM4 MEANWELL_NID100_1.COM4 MEANWELL_NID100_1.COM3 MEANWELL_NID100_1.COM2 39.37,50.16 | X1.4 X1.3 5.71,34.93 5.71,60.33 5.99,60.33 R6.1 26.4,50.8 MEANWELL_NID100_1.COM1 39.37,50.16 | 117.48,26.04 135.89,7.62 U$1.G2 152.4,7.62 154.94,10.16 154.94,12.7 | v152.4,44.45 U$1.G 154.94,35.56 154.94,12.7 | v152.4,50.8 153.67,52.07 J2.15 J2.13 J2.11 J2.9 J2.7 J2.5 J2.3 J2.1
  Top 0.61: LED5.P$2 122.87,111.44 C1.1 122.87,117.79 v123.19,118.11 | LED6.P$2 139.38,111.44 C2.1 139.38,117.79 v139.7,118.11 | LED7.P$2 154.62,111.44 C3.1 154.62,117.79 v154.94,118.11 | LED8.P$2 173.67,111.44 C4.1 173.67,117.79 v173.99,118.11 | LED9.P$2 192.72,111.44 C5.1 192.72,117.79 v193.04,118.11 | C6.1 209.23,111.44 LED10.P$2 | LED12.P$2 227.83,84.27 C8.1 | C6.1 209.55,115.89 | v209.55,118.11 209.23,117.79 C6.1
  Bottom 0.61: v152.4,44.45 v152.4,50.8 | ORPHAN_OUT.1 106.68,139.7 125.73,139.7 | 125.73,139.7 125.96,139.47 J12.1 | 125.73,139.7 142.24,139.7 | 142.24,139.7 160.02,139.7 | 160.02,139.7 177.8,139.7 | 177.8,139.7 194.31,139.7 | 194.31,139.7 210.82,139.7 | 210.82,139.7 226.06,139.7 227.56,138.2 J9.1 234.97,135.87 GND40.P1 X2.5 | 142.24,139.7 142.47,139.47 J11.1 | 160.02,139.7 160.25,139.47 J8.1 | 177.8,139.7 178.03,139.47 J7.1 | 194.31,139.7 194.54,139.47 J6.1 | 210.82,139.7 211.05,139.47 J4.1 | J2.15 205.74,27.94 J3.1 214.63,7.62 GND36.P1 231.14,12.7 231.14,19.05 236.22,24.13 AUDIOTRIGGER.1 | LED11.P$2 222.75,94.48 LED12.P$2 | v123.19,120.65 v123.19,118.11 | v139.7,120.65 v139.7,118.11 | v154.94,120.65 v154.94,118.11 | v173.99,120.65 v173.99,118.11 | v193.04,120.65 v193.04,118.11 | v209.55,120.65 v209.55,118.11
  pour Bottom: 1.27,0 1.27,142.24 243.84,142.24 243.84,0
MISO  (via drill 0.35)
  Top 0.61: R5.2 109.37,100.65 110.17,100.65 123.19,87.63 123.19,83.82 v147.32,59.69
  Bottom 0.61: U$1.MISO 161.29,39.37 161.29,45.72 v147.32,59.69
N$1
  Top 0.61: LED4.A 118.11,74.29 118.11,61.6 MEANWELL_NID100_2.+VOUT1
  Top 1.905: ORPHAN_OUT.3 90.17,118.42 arc90 U$3.1 90.48,115.57 90.48,64.77 arc90 94.29,60.96 MEANWELL_NID100_2.+VOUT1 MEANWELL_NID100_2.+VOUT2 MEANWELL_NID100_2.+VOUT3 MEANWELL_NID100_2.+VOUT4
N$7
  Top 0.61: 27.94,74.61 38.73,74.61 LED2.A
  Top 1.905: CONNECT_OUT.3 27.94,116.84 | 27.94,116.84 U$5.1 | 27.94,116.84 27.94,74.61 27.94,63.5 arc90 30.48,60.96 MEANWELL_NID100_1.+VOUT1 MEANWELL_NID100_1.+VOUT2 MEANWELL_NID100_1.+VOUT3 MEANWELL_NID100_1.+VOUT4
N$9
  Top 0.61: R1.2 93.66,108.9 93.66,132.08 94.93,133.35 ORPHAN_OUT.2
N$10
  Top 0.61: R1.1 94.77,96.99 94.93,96.84 109.86,96.84 121.29,85.41 121.29,51.44 137.16,35.56 137.16,30.48 139.7,27.94 U$1.#5
N$11
  Top 0.61: R2.2 52.7,108.9 52.7,132.4 53.66,133.35 NODE_OUT.2
N$15
  Top 0.61: R2.1 52.7,96.84 52.7,71.12 77.15,46.67 101.6,46.67 122.87,25.4 U$1.#7
N$16
  Top 0.61: CONNECT_OUT.2 32.38,132.72 32.38,108.9 R3.2
N$18
  Top 0.61: R4.2 73.34,108.9 73.34,132.4 74.3,133.35 WORD_OUT.2
N$33
  Top 0.61: R5.1 110.49,112.56 111.23,112.56 118.85,112.56 LED5.P$4
  Top 0.813: R5.1 107.95,111.29 107.95,107.95 106.68,106.68 JP1.2
N$34
  Top 0.61: R6.2 11.43,57.79 LED1.C
N$35
  Top 0.61: R7.2 118.11,83.82 118.11,78.1 LED4.C
N$36
  Top 0.61: R8.2 78.74,83.82 78.74,78.1 LED3.C
N$37
  Top 0.61: R9.2 39.05,83.82 39.05,78.1 LED2.C
N$38
  Top 0.61: LED5.P$1 124.42,110.99 LED6.P$4
N$41
  Top 0.61: LED6.P$1 151.17,109.99 LED7.P$4
N$43
  Top 0.61: LED7.P$1 156.17,110.99 LED8.P$4
N$45
  Top 0.61: LED8.P$1 175.22,110.99 LED9.P$4
N$47
  Top 0.61: LED9.P$1 205.78,109.99 LED10.P$4
N$49
  Top 0.61: LED10.P$1 210.78,110.99 LED11.P$4
N$51  (via drill 0.35)
  Top 0.61: LED11.P$1 223.75,103.1 v218.44,97.79 | v218.44,90.17 219.71,88.9 225.33,88.9 LED12.P$4
  Bottom 0.61: v218.44,97.79 v218.44,90.17
SCL  (via drill 0.35)
  Top 0.61: v138.43,74.93 142.24,78.74 157.48,78.74 173.99,95.25 218.44,95.25 X2.3
  Bottom 0.61: U$1.#3/SCL 138.43,34.29 v138.43,74.93
SDA  (via drill 0.35)
  Top 0.61: v139.7,73.66 142.24,76.2 157.48,76.2 173.99,92.71 219.71,92.71 234.95,107.95 X2.2
  Bottom 0.61: U$1.#2/SDA 139.7,35.56 v139.7,73.66

### Text on the board
tPlace: OMSI Brain Connections / Main Board - 6/30/2020 / Daniel Smolentsev & DGTL | GND | VIN | Triggers | GND | T1 | T2 | T3 | T4 | T5 | T6 | T7 | T8 | Triggers | GND | T9 | T10 | T11 | T12 | T13 | T14 | T15 | T16 | GND | 5VIn
tNames: +5V | CONN / OUT | GND | +5V | NODE / OUT | GND | +5V | WORD / OUT | GND | +5V | ORPHAN / OUT | GND | 5V | 5V | 5V | 5V | 5V | 5V | 5V | GND | OPTO1 IN | GND | OPTO2 IN | GND | OPTO3 IN | GND | OPTO4 IN | GND | OPTO5 IN | GND | OPTO6 IN | GND | OPTO7 IN | GND | C1 | NC | SCL | SDA | Gnd D 5V | INPUT 1 / STATUS | INPUT 2 / STATUS | INPUT 3 / STATUS | INPUT 4 / STATUS | INPUT 5 / STATUS | INPUT 6 / STATUS | INPUT 7 / STATUS | +5V | ADXL 343 | ADXL / SENSOR / STATUS | Wav Trigger | 5 V #1 / Status | 5 V #2 / Status | 5 V #3 / Status | AUDIO TRIGGER 1 | AUDIO TRIGGER 2 | 640 | AUDIO TRIGGER 3 | AUDIO TRIGGER 4 | AUDIO TRIGGER 5 | 12 V / Status | +12V | ( optional ) ( optional ) ( optional ) / Wav Trigger Alternative Connector | +12V | GND | NIB-100 DC-DC / 5V 11A regulator | 32U4MEGA / ITSYBITSY | NIB-100 DC-DC / 5V 11A regulator | NIB-100 DC-DC / 5V 11A regulator | GND | POWER IN
tValues: C1-C7 : 100nF